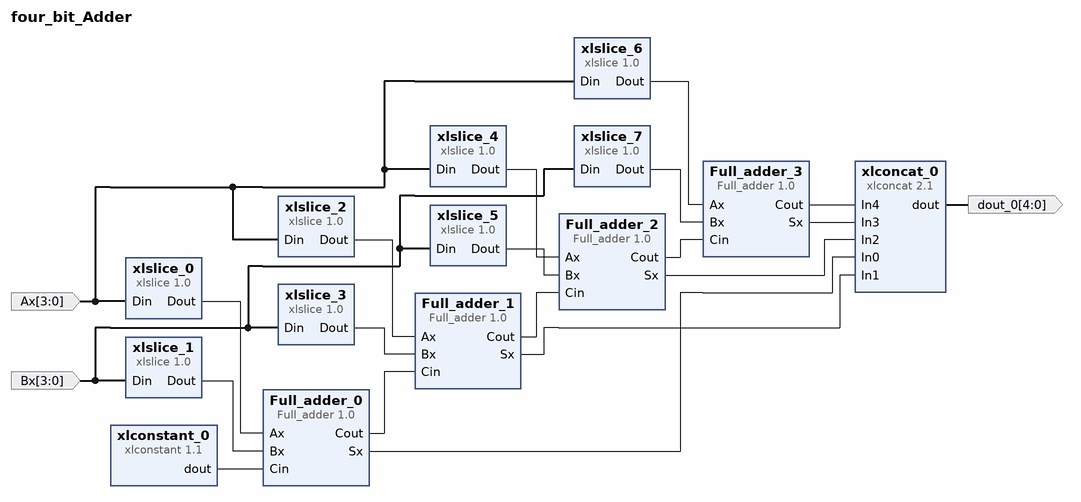
[diagram p0: block diagram of the top level]
# Vivado block design four_bit_Adder, xc7a100tcsg324-1, Vivado 2025.1
create_bd_design four_bit_Adder

create_bd_port -dir O -from 4 -to 0 dout_0
create_bd_port -dir I -from 3 -to 0 Ax
create_bd_port -dir I -from 3 -to 0 Bx

create_bd_cell -type ip -vlnv xilinx.com:user:Full_adder:1.0 Full_adder_0
create_bd_cell -type ip -vlnv xilinx.com:user:Full_adder:1.0 Full_adder_1
create_bd_cell -type ip -vlnv xilinx.com:user:Full_adder:1.0 Full_adder_2
create_bd_cell -type ip -vlnv xilinx.com:user:Full_adder:1.0 Full_adder_3
create_bd_cell -type ip -vlnv xilinx.com:ip:xlconstant:1.1 xlconstant_0
set_property -dict {CONFIG.CONST_VAL 1} [get_bd_cells xlconstant_0]
create_bd_cell -type ip -vlnv xilinx.com:ip:xlconcat:2.1 xlconcat_0
set_property -dict {CONFIG.NUM_PORTS 5} [get_bd_cells xlconcat_0]
create_bd_cell -type ip -vlnv xilinx.com:ip:xlslice:1.0 xlslice_0
set_property -dict {CONFIG.DIN_FROM 0 CONFIG.DIN_WIDTH 4 CONFIG.DOUT_WIDTH 1} [get_bd_cells xlslice_0]
create_bd_cell -type ip -vlnv xilinx.com:ip:xlslice:1.0 xlslice_1
set_property -dict {CONFIG.DIN_FROM 0 CONFIG.DIN_TO 0 CONFIG.DIN_WIDTH 4 CONFIG.DOUT_WIDTH 1} [get_bd_cells xlslice_1]
create_bd_cell -type ip -vlnv xilinx.com:ip:xlslice:1.0 xlslice_2
set_property -dict {CONFIG.DIN_FROM 1 CONFIG.DIN_TO 1 CONFIG.DIN_WIDTH 4 CONFIG.DOUT_WIDTH 1} [get_bd_cells xlslice_2]
create_bd_cell -type ip -vlnv xilinx.com:ip:xlslice:1.0 xlslice_3
set_property -dict {CONFIG.DIN_FROM 1 CONFIG.DIN_TO 1 CONFIG.DIN_WIDTH 4 CONFIG.DOUT_WIDTH 1} [get_bd_cells xlslice_3]
create_bd_cell -type ip -vlnv xilinx.com:ip:xlslice:1.0 xlslice_4
set_property -dict {CONFIG.DIN_FROM 2 CONFIG.DIN_TO 2 CONFIG.DIN_WIDTH 4 CONFIG.DOUT_WIDTH 1} [get_bd_cells xlslice_4]
create_bd_cell -type ip -vlnv xilinx.com:ip:xlslice:1.0 xlslice_5
set_property -dict {CONFIG.DIN_FROM 2 CONFIG.DIN_TO 2 CONFIG.DIN_WIDTH 4 CONFIG.DOUT_WIDTH 1} [get_bd_cells xlslice_5]
create_bd_cell -type ip -vlnv xilinx.com:ip:xlslice:1.0 xlslice_6
set_property -dict {CONFIG.DIN_FROM 3 CONFIG.DIN_TO 3 CONFIG.DIN_WIDTH 4 CONFIG.DOUT_WIDTH 1} [get_bd_cells xlslice_6]
create_bd_cell -type ip -vlnv xilinx.com:ip:xlslice:1.0 xlslice_7
set_property -dict {CONFIG.DIN_FROM 3 CONFIG.DIN_TO 3 CONFIG.DIN_WIDTH 4 CONFIG.DOUT_WIDTH 1} [get_bd_cells xlslice_7]

# ---- connections ----

connect_bd_net [get_bd_ports Ax] [get_bd_pins xlslice_0/Din] [get_bd_pins xlslice_2/Din] [get_bd_pins xlslice_4/Din] [get_bd_pins xlslice_6/Din]
connect_bd_net [get_bd_ports Bx] [get_bd_pins xlslice_1/Din] [get_bd_pins xlslice_3/Din] [get_bd_pins xlslice_5/Din] [get_bd_pins xlslice_7/Din]
connect_bd_net [get_bd_pins Full_adder_0/Cout] [get_bd_pins Full_adder_1/Cin]
connect_bd_net [get_bd_pins Full_adder_0/Sx] [get_bd_pins xlconcat_0/In0]
connect_bd_net [get_bd_pins Full_adder_1/Cout] [get_bd_pins Full_adder_2/Cin]
connect_bd_net [get_bd_pins Full_adder_1/Sx] [get_bd_pins xlconcat_0/In1]
connect_bd_net [get_bd_pins Full_adder_2/Cout] [get_bd_pins Full_adder_3/Cin]
connect_bd_net [get_bd_pins Full_adder_2/Sx] [get_bd_pins xlconcat_0/In2]
connect_bd_net [get_bd_pins Full_adder_3/Cout] [get_bd_pins xlconcat_0/In4]
connect_bd_net [get_bd_pins Full_adder_3/Sx] [get_bd_pins xlconcat_0/In3]
connect_bd_net [get_bd_pins xlconcat_0/dout] [get_bd_ports dout_0]
connect_bd_net [get_bd_pins xlconstant_0/dout] [get_bd_pins Full_adder_0/Cin]
connect_bd_net [get_bd_pins xlslice_0/Dout] [get_bd_pins Full_adder_0/Ax]
connect_bd_net [get_bd_pins xlslice_1/Dout] [get_bd_pins Full_adder_0/Bx]
connect_bd_net [get_bd_pins xlslice_2/Dout] [get_bd_pins Full_adder_1/Ax]
connect_bd_net [get_bd_pins xlslice_3/Dout] [get_bd_pins Full_adder_1/Bx]
connect_bd_net [get_bd_pins xlslice_4/Dout] [get_bd_pins Full_adder_2/Ax]
connect_bd_net [get_bd_pins xlslice_5/Dout] [get_bd_pins Full_adder_2/Bx]
connect_bd_net [get_bd_pins xlslice_6/Dout] [get_bd_pins Full_adder_3/Ax]
connect_bd_net [get_bd_pins xlslice_7/Dout] [get_bd_pins Full_adder_3/Bx]

validate_bd_design
save_bd_design
